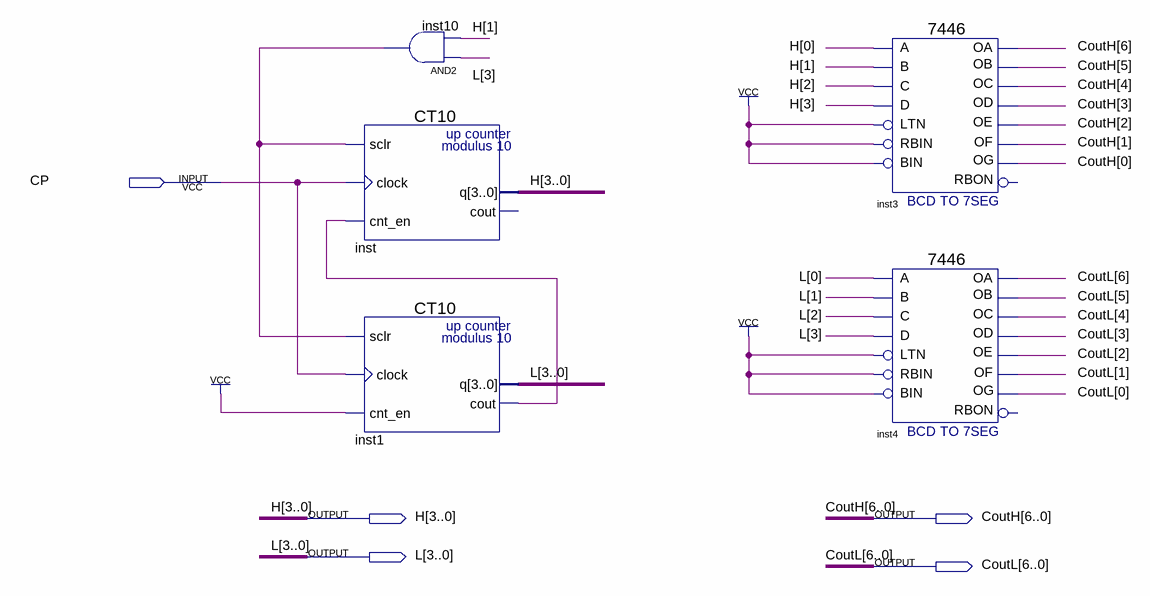
[diagram p0: schematic sheet]
// Quartus schematic 29procress.bdf as structural Verilog: 5 symbols, 5 pins
module \29procress  (
  input  CP,
  output [3:0] H,
  output [6:0] CoutH,
  output [3:0] L,
  output [6:0] CoutL
);

  wire inst1_cout, inst10_out;

  CT10 inst (.sclr(inst10_out), .clock(CP), .cnt_en(inst1_cout), .q(H));  // open: cout
  CT10 inst1 (.sclr(inst10_out), .clock(CP), .cnt_en(1'b1), .q(L), .cout(inst1_cout));
  and inst10 (inst10_out, L[3], H[1]);
  \7446  inst3 (
    .D(H[3]), .C(H[2]), .B(H[1]), .LTN(1'b1), .A(H[0]), .RBIN(1'b1), .BIN(1'b1), .OC(CoutH[4]),
    .OD(CoutH[3]), .OE(CoutH[2]), .OA(CoutH[6]), .OB(CoutH[5]), .OF(CoutH[1]), .OG(CoutH[0]));  // open: RBON
  \7446  inst4 (
    .D(L[3]), .C(L[2]), .B(L[1]), .LTN(1'b1), .A(L[0]), .RBIN(1'b1), .BIN(1'b1), .OC(CoutL[4]),
    .OD(CoutL[3]), .OE(CoutL[2]), .OA(CoutL[6]), .OB(CoutL[5]), .OF(CoutL[1]), .OG(CoutL[0]));  // open: RBON
endmodule
